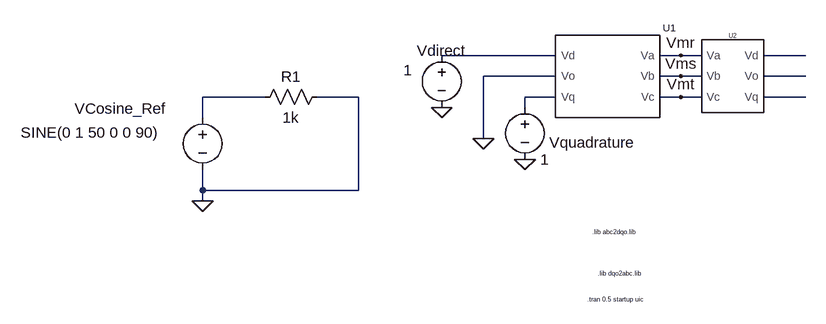
[diagram p0: schematic dqoabc2.asc]
dqoabc2.asc, the LTspice schematic file:
Version 4
SHEET 1 3872 1864
WIRE 48 288 -128 288
WIRE 240 288 208 288
WIRE 272 288 240 288
WIRE 432 288 368 288
WIRE 48 320 -64 320
WIRE 240 320 208 320
WIRE 272 320 240 320
WIRE 432 320 368 320
WIRE -400 352 -496 352
WIRE -256 352 -320 352
WIRE 48 352 0 352
WIRE 240 352 208 352
WIRE 272 352 240 352
WIRE 432 352 368 352
WIRE 0 368 0 352
WIRE -496 384 -496 352
WIRE -64 416 -64 320
WIRE -496 496 -496 464
WIRE -256 496 -256 352
WIRE -256 496 -496 496
WIRE -496 512 -496 496
FLAG 240 288 Vmr
FLAG 240 320 Vms
FLAG 240 352 Vmt
FLAG -128 368 0
FLAG -64 416 0
FLAG 0 448 0
FLAG -496 512 0
SYMBOL voltage -128 272 R0
WINDOW 123 0 0 Left 0
WINDOW 39 0 0 Left 0
WINDOW 0 -38 9 Left 2
WINDOW 3 -59 39 Left 2
SYMATTR InstName Vdirect
SYMATTR Value 1
SYMBOL voltage 0 352 R0
WINDOW 123 0 0 Left 0
WINDOW 39 0 0 Left 0
WINDOW 0 38 70 Left 2
SYMATTR InstName Vquadrature
SYMATTR Value 1
SYMBOL dqabc 128 320 R0
SYMATTR InstName U1
SYMBOL voltage -496 368 R0
WINDOW 0 -197 2 Left 2
WINDOW 3 -280 39 Left 2
WINDOW 123 0 0 Left 0
WINDOW 39 0 0 Left 0
SYMATTR InstName VCosine_Ref
SYMATTR Value SINE(0 1 50 0 0 90)
SYMBOL res -304 336 R90
WINDOW 0 0 56 VBottom 2
WINDOW 3 32 56 VTop 2
SYMATTR InstName R1
SYMATTR Value 1k
SYMBOL abc2dqo 320 320 R0
SYMATTR InstName U2
TEXT 96 664 Left 0 !.tran 0.5 startup uic
TEXT 112 624 Left 0 !.lib dqo2abc.lib
TEXT 104 560 Left 0 !.lib abc2dqo.lib

The netlist it stands for:
* dqoabc2.asc
Vdirect N001 0 1
Vquadrature N005 0 1
XU1 N001 0 N005 Vmr Vms Vmt dqo2abc  ; pins Vd Vo Vq Va Vb Vc
VCosine_Ref N004 0 SINE(0 1 50 0 0 90)
R1 0 N004 1k
XU2 Vmr Vms Vmt N002 N003 N006 abc2dqo  ; pins Va Vb Vc Vd Vo Vq
.tran 0.5 startup uic
.lib dqo2abc.lib
.lib abc2dqo.lib
.backanno
.end